# Altium project PCB_Project.PrjPcb
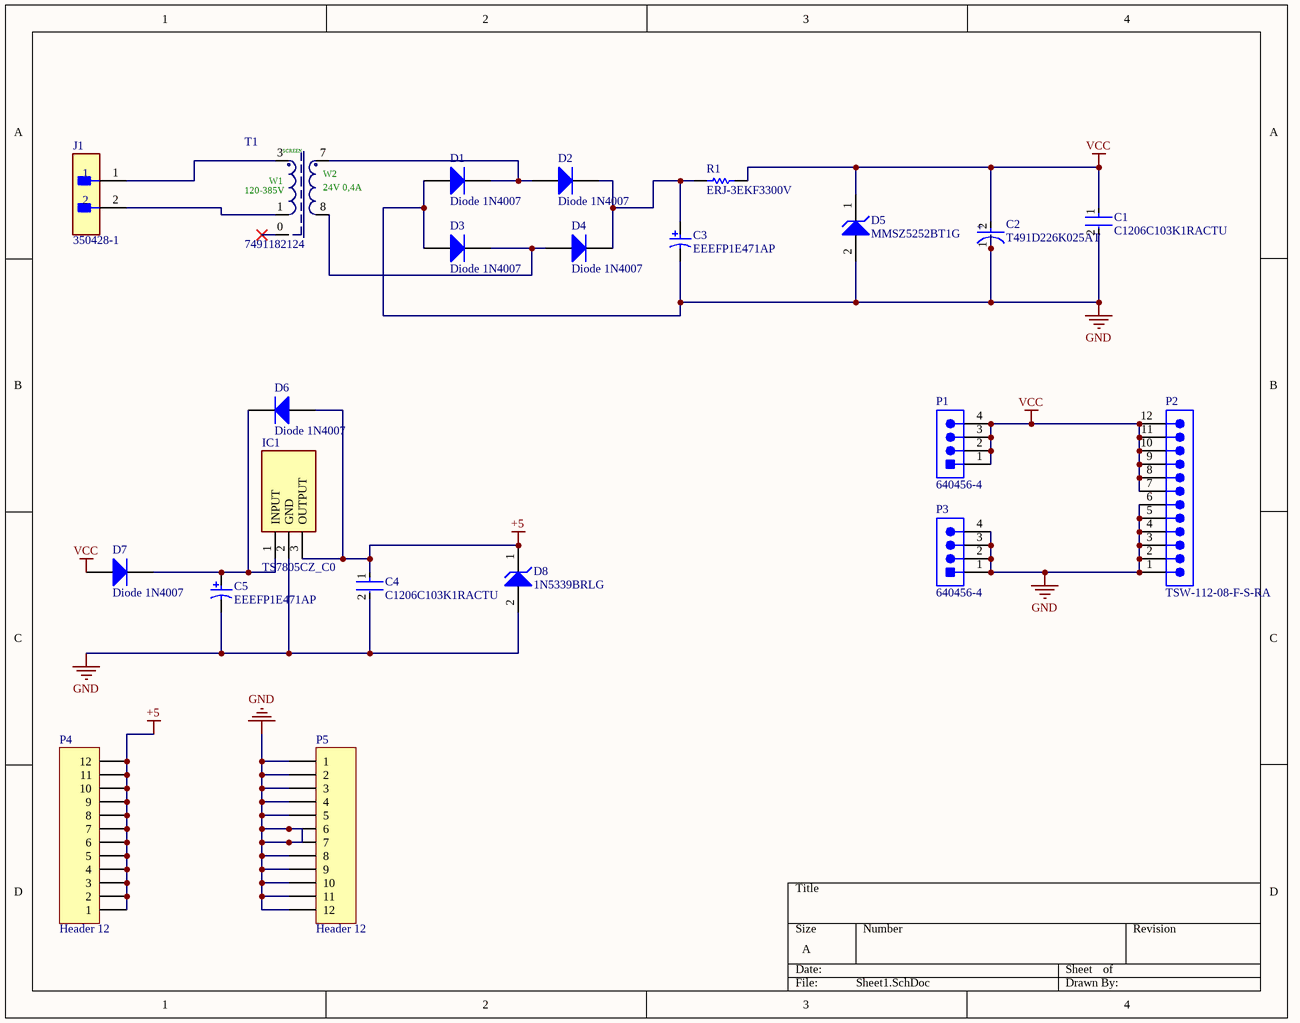
[diagram p0: Sheet1.SchDoc]
1 sheet, 22 parts. Net scope: global (net labels, ports and power ports of the same name join across sheets).
Board file: PCB1.PcbDoc

## Sheet Sheet1.SchDoc
size A; SheetNumber: 1; SheetTotal: 1

### Parts
C1  C1206C103K1RACTU  [FP-C1206C-EB-MFG]
C2  T491D226K025AT  [FP-T491D226K025AT-MFG]
C3  EEEFP1E471AP  [PNSC-FP-V-G_V]
C4  C1206C103K1RACTU  [FP-C1206C-EB-MFG]
C5  EEEFP1E471AP  [PNSC-FP-V-G_V]
D1  Diode 1N4007  [DO-41]
D2  Diode 1N4007  [DO-41]
D3  Diode 1N4007  [DO-41]
D4  Diode 1N4007  [DO-41]
D5  MMSZ5252BT1G  [ONSC-SOD-123-2-425-04_V]
D6  Diode 1N4007  [DO-41]
D7  Diode 1N4007  [DO-41]
D8  1N5339BRLG  [ONSC-SURMETIC40-2-017AA-01]
IC1  TS7805CZ_C0  [TO254P483X1000X2285-3P]
J1  350428-1  [FP-350428-1-MFG]
P1  640456-4  [TECO-640456-4]
P2  TSW-112-08-F-S-RA  [SMTC-TSW-112-08-X-S-RA]
P3  640456-4  [TECO-640456-4]
P4  Header 12  [HDR1X12]
P5  Header 12  [HDR1X12]
R1  ERJ-3EKF3300V  [RESC1608X55X30LL15T15]
T1  7491182124  [EE16_8_5 (EF16)]

### Nets
+5: C4.1 D6.1(A) D8.1(K) IC1.3(OUTPUT) P4.1 P4.2 P4.3 P4.4 P4.5 P4.6 P4.7 P4.8 P4.9 P4.10 P4.11 P4.12
GND: C1.2 C2.1(C) C3.2 C4.2 C5.2 D1.1(A) D3.1(A) D5.2(A) D8.2(A) IC1.2(GND) P2.1 P2.2 P2.3 P2.4 P2.5 P2.6 P3.1 P3.2 P3.3 P3.4 P5.1 P5.2 P5.3 P5.4 P5.5 P5.6 P5.7 P5.8 P5.9 P5.10 P5.11 P5.12
VCC: C1.1 C2.2(A) D5.1(K) D7.1(A) P1.1 P1.2 P1.3 P1.4 P2.7 P2.8 P2.9 P2.10 P2.11 P2.12 R1.2
NetC3_1: C3.1 D2.2(K) D4.2(K) R1.1
NetC5_1: C5.1 D6.2(K) D7.2(K) IC1.1(INPUT)
NetD1_2: D1.2(K) D2.1(A) T1.7
NetD3_2: D3.2(K) D4.1(A) T1.8
NetJ1_1: J1.1 T1.3
NetJ1_2: J1.2 T1.1

Not connected (* = marked no-connect by the designer): T1 0*

### Notes on the sheet
- (in symbol CMP-1476-00010-1) SCREEN; W2; W1; 120-385V; 24V 0,4A
- (in symbol CMP-03017-000021-1) +

### Library data of the parts
C1 C4 = CMP-03020-021723-1: Cap Ceramic 0.01uF 100V X7R 10% SMD 1206 125°C Plastic T/R; Manufacturer: KEMET; Temperature Coefficient: 15%; Tolerance: 0.1; Capacitance: 10,000 pF; Value: 10,000 pF; Automotive Grade: Grade 0; Description: C1206 10,000 pF X7R 10.00% 100 V; Device Class L3: Ceramic Capacitors; Ipc Land Pattern Name: CAPC320160X78; Temperature Characteristic: X7R; Material: Ceramic; Category: Cap; Device Class L2: Capacitors; RoHS: TRUE; Manufacturer Part Number: C1206C103K1RACTU; Mouser Description: Multilayer Ceramic Capacitors MLCC - SMD/SMT 100volts 10000pF X7R 10%; Octopart: https://octopart.com/c1206c103k1ractu-kemet-117927; Temperature: -55°C to +150°C; Temperature Range Low: -55°C; Lead Free: Yes; Automotive: Yes; ComponentLink2URL: https://content.kemet.com/datasheets/KEM_C1007_X8R_ULTRA_150C_SMD.pdf; Package: C1206C-EB; Voltage Rating: 100 V; Temperature Range High: +150°C; ComponentLink2Description: Datasheet; Height: 0.88mm; Device Class L1: Passive Components; Digikey Description: Cap Ceramic 0.01uF 100V X7R 10% SMD 1206 125°C Plastic T/R
C2 = CMP-03017-000021-1: CAP TANT 22UF 10% 25V 2917; Ripple Current: 433mA; Leakage Current: 5.5uA; Polarity: Polar; Dielectric Material: Tantalum; ESR (Equivalent Series Resistance): 800mR; Life (Hours): 2000Hour; Dissipation Factor: 6%; Voltage Rating: 25V; Capacitance: 22uF; Min Operating Temperature: -55°C; Length: 7.3mm; Case Code (Metric): 7343; Radiation Hardening: No; Tolerance: 10%; Case Code (Imperial): 2917; Lead Free: Lead Free; Number of Pins: 2; Mount: Surface Mount; Case/Package: 2917; Voltage Rating (DC): 25V; Termination: SMD/SMT; Voltage: 25V; Height: 2.8mm; Features: General Purpose; Depth: 4.3mm; REACH SVHC: No SVHC; Package Quantity: 1; Packaging: Tape and Reel; Height - Seated (Max): 0.122inch; Width: 4.3mm; Max Operating Temperature: 125°C
C3 C5 = CMP-2000-06214-1: Aluminum Electrolytic Capacitor, 470 uF, +/- 20%, 25 V, 2-Pin SMD (Size Code G), -55 to 105 degC, RoHS, Tape and Reel; Manufacturer: Panasonic; Capacitance: 470µF; Ripple Current: 1190mA; ESR (Equivalent Series Resistance): 0.06O; Type: Can; Rated Voltage: 25V; Lifetime@Temperature: 2000Hrs@105°C; Package Reference: FP-V-G; Case Size/Dimension: Ø10x10.2mm; Mounting Technology: SurfaceMount; Datasheet Version: 03/2016; Datasheet URL: http://industrial.panasonic.com/cdbs/www-data/pdf/RDE0000/ABA0000C1184.pdf; Series: FP; Operating Temp Range: -55to+105°C; Operating Temp-Max: 105°C; Package URL: http://industrial.panasonic.com/cdbs/www-data/pdf/RDE0000/DME0000COL48.pdf; Package Description: 2-Pin Electrolytic Aluminum Capacitor, Body 10.3 x 10.3 mm; Manufacturer URL: http://www.panasonic.com/
D1-D4 D6 D7 = Diode 1N4007: 1 Amp General Purpose Rectifier; Published: 8-Jun-2000; LatestRevisionDate: 17-Jul-2002; LatestRevisionNote: Re-released for DXP Platform.; DatasheetVersion: 1998; PackageVersion: Aug-1999; PackageReference: DO-41; Publisher: Altium Limited; PackageDescription: Diode, Axial; Body 5.2 x 2.7 mm (LxDia. max), Lead Dia. 0.86 mm (max); Code_JEDEC: DO-204-AL; ComponentLink1Description: Manufacturer Link; ComponentLink1URL: http://www.fairchildsemi.com/; ComponentLink2Description: Datasheet; ComponentLink2URL: http://www.fairchildsemi.com/ds/1N%2F1N4001.pdf
D5 = CMP-1060-00444-1: Zener Voltage Regulator, 500 mW, 2-Pin SOD-123, Pb-Free, Tape and Reel; Manufacturer: On Semiconductor; VZ Typ (V): 24; P Max (W): 0.5; RoHS: Pb-Free; Mounting Technology: Surface Mount; ComponentLink2Description: Datasheet; ComponentLink3URL: http://www.onsemi.com/pub_link/Collateral/425-04.PDF; PackageVersion: Rev. G, 10/2009; ComponentLink3Description: Package Specification; PackageReference: SOD-123-2-425-04; ComponentLink1Description: Manufacturer URL; DatasheetVersion: Rev. 12; Packing: Tape and Reel; PartNumber: MMSZ5252BT1G; ComponentLink2URL: http://www.onsemi.com/pub_link/Collateral/MMSZ5221BT1-D.PDF; ComponentLink1URL: http://www.onsemi.com/; PackageDescription: 2-Pin SOD, Body 1.6 x 2.69 mm
D8 = CMP-1060-01298-1: 5 W Zener Voltage Regulator, 2-Pin Surmetic(TM) 40, Pb-Free, Tape and Reel; Manufacturer: On Semiconductor; VZ Typ (V): 5.6; P Max (W): 5; ComponentLink3URL: http://www.onsemi.cn/pub_link/Collateral/017AA.PDF; PackageDescription: 2-Pin, Axial Lead, Diameter 3.49 mm; ComponentLink2URL: http://www.onsemi.cn/pub_link/Collateral/1N5333B-D.PDF; PackageReference: SURMETIC40-2-017AA-01; ComponentLink3Description: Package Specification; RoHS: Pb-Free; ComponentLink1URL: http://www.onsemi.com/; PackageVersion: Rev. O, 09/2005; PartNumber: 1N5339BRLG; ComponentLink1Description: Manufacturer URL; Mounting Technology: Through Hole; ComponentLink2Description: Datasheet; DatasheetVersion: Rev. 14; Packing: Tape and Reel
IC1 = TS7805CZ_C0: Integrated Circuit; Manufacturer_Name: Taiwan Semiconductor; Manufacturer_Part_Number: TS7805CZ C0; Datasheet Link: http://www.taiwansemi.com/products/datasheet/TS7800_G1612.pdf; Height: 4.83mm; Mouser Part Number: 821-TS7805CZC0; Mouser Price/Stock: https://www.mouser.com/Search/Refine.aspx?Keyword=821-TS7805CZC0; Arrow Part Number: TS7805CZ C0; Arrow Price/Stock: https://www.arrow.com/en/products/ts7805czc0/taiwan-semiconductor
J1 = CMP-03369-000080-1: CONN HEADER VERT 2POS 6.35MM; Manufacturer: TE Connectivity; Standoff Height: 0.63mm; Number Of Contacts: 2; Conn Gender: Male; Voltage Rating: 600V; Conn Orientation: Vertical; Current Rating: 12A; Number Of Rows: 1; Mouser Description: Connector, Soft Shell; Universal MATE-N-LOK; 2; Nylon; Natural; 19 A; 600 VAC; Height: 14.99mm; Pitch: 6.35mm; ComponentLink2URL: https://www.te.com/commerce/DocumentDelivery/DDEController?Action=showdoc&DocId=Customer+Drawing%7F350428%7FY2%7Fpdf%7FEnglish%7FENG_CD_350428_Y2.pdf%7F350428-1; Device Class L1: Connectors; Automotive: No; Octopart: https://octopart.com/350428-1-te+connectivity-46505355; Digikey Description: CONN HEADER VERT 2POS 6.35MM; RoHS: TRUE; Temperature: -40°C to +105°C; Contact Material: Gold,Nickel; Package: 350428-1; Temperature Range Low: -40°C; Device Class L3: unset; Lead Free: Yes; Device Class L2: Headers and Wire Housings; Category: Conn; ComponentLink2Description: Datasheet; Temperature Range High: +105°C; Manufacturer Part Number: 350428-1
P1 P3 = CMP-2000-05419-1: Male Header, Pitch 2.54 mm, 1 x 4 Position, Height 10.03 mm, Tail Length 3.56 mm, RoHS, Bulk; Manufacturer: TE Connectivity; Material, Housing: Polyester; Primary Type: InterconnectSystem; Mount Angle: Vertical; Color, Housing: White; Current, Rating: 5 / A; Agency Approvals: CSA,UL; Contact Termination Area Plating: Tin; Temperature, Operating: -55to+105 / degC; Standards: RoHSCompliant,ELVCompliant,UL94V-0; Number of Positions: 4; Brand/Series: MTA-100Series; Angle: Straight; Pin Spacing: 0.1 / "; Material, Contact: CopperAlloy; Connector Type: MTA-100; Special Features: Pinstrip; Mounting Hole Size: 0.04 / "; Contact Centerline Spacing: 0.100 / in.; Voltage, Rating: 250 / V; Manufacturer URL: http://www.te.com/; Length, Pin: 0.14 / "; Length, Overall: 0.4 / "; Color: White; Flammability Rating: UL94V-0; Mounting Type: PCMount; Termination: Solder; Datasheet URL: https://datasheet.ciiva.com/16286/eng-ds-82056-mta-0608-16286228.pdf; Number of Contacts: 4; Contact Shape: Square; Contact Mating Area Plating: Tin; Length, Terminal Post: 0.14 / in.; Size, Post: 0.025 / in.; Contact Plating: Tin; Type: PCBPlug; Datasheet Version: Dec-14; Number of Rows: 1
P2 = CMP-1024-00428-1: 0.025" SQ Post Header, Through-hole, Right Angle, -55 to 125 degC, 2.54 mm Pitch, 12-Pin, Male, RoHS; Manufacturer: Samtec; Pitch: 2.54 mm; ComponentLink2URL: http://www.samtec.com/documents/webfiles/pdf/TSW_TH.PDF; ComponentLink2Description: Datasheet; PartNumber: TSW-112-08-F-S-RA; ComponentLink3Description: Package Specification; DatasheetVersion: F-214; PackageReference: TSW-112-08-X-S-RA; PackageVersion: DM, 8/1988; Temperature Range: -55 to 125 degC; Mounting Technology: Through-hole; ComponentLink1Description: Manufacturer URL; RoHS: True; Orientation: Right Angle; ComponentLink1URL: http://www.samtec.com; ComponentLink3URL: http://www.samtec.com/documents/webfiles/cpdf/TSW-XXX-XX-XXX-X-XX-XXX-MKT.pdf; PackageDescription: .025[0.64] SQ. Post Terminal Strip Assembly
P4 P5 = Header 12: Header, 12-Pin; LatestRevisionDate: 17-Jul-2002; LatestRevisionNote: Re-released for DXP Platform.; Publisher: Altium Limited
R1 = CMP-2000-00435-2: Chip Resistor, 330 Ohm, +/- 1%, 0.1 W, -55 to 155 degC, 0603 (1608 Metric), RoHS, Tape and Reel; Gender: Male; Mating Cycles: 10000; Current Rating: 500 mA; Voltage Rating: 10 V; REACH SVHC: No SVHC; PackageDescription: 2-Pin Surface Mount Device, Body 1.6 x 0.85 mm; Contact Finish: Gold; Pins: 8; ComponentLink1Description: Manufacturer URL; Packaging: Tape and Reel; Max Operating Temperature: 85 degC; Contact Material: Copper; Height: 1.45 mm; Width: 1.45 mm; DatasheetVersion: Apr-15; Package Quantity: 1500; Contact Plating: Gold; PackageReference: 0603; Mount: Surface Mount; Lead Pitch: 1.1 mm; Min Operating Temperature: -25 degC; ComponentLink1URL: http://www.panasonic.com/; ComponentLink2URL: http://industrial.panasonic.com/cdbs/www-data/pdf/RDA0000/AOA0000C86.pdf; Length: 13.7 mm; ComponentLink2Description: Datasheet; RoHSCompliant: true
T1 = CMP-1476-00010-1: Off-Line Transformer WE-UNIT , L=0.9mH; Manufacturer: Wuerth Elektronik; Turns Ratio: "4.4","1"; Output current (A): 0.125; Inductance: 0.9mH; Output Voltage (DC): 24; Input Voltage (AC): 85-265; ComponentLink1Description: Manufacturer URL; ComponentLink1URL: http://www.we-online.com; ComponentLink2URL: http://www.we-online.de/katalog/media/pdf/7491182124.pdf; PartNumber: 7491182124; ComponentLink2Description: Datasheet; PackageReference: EE16_8_5 (EF16)